# Altium project UPS_Input_Board.PrjPcb
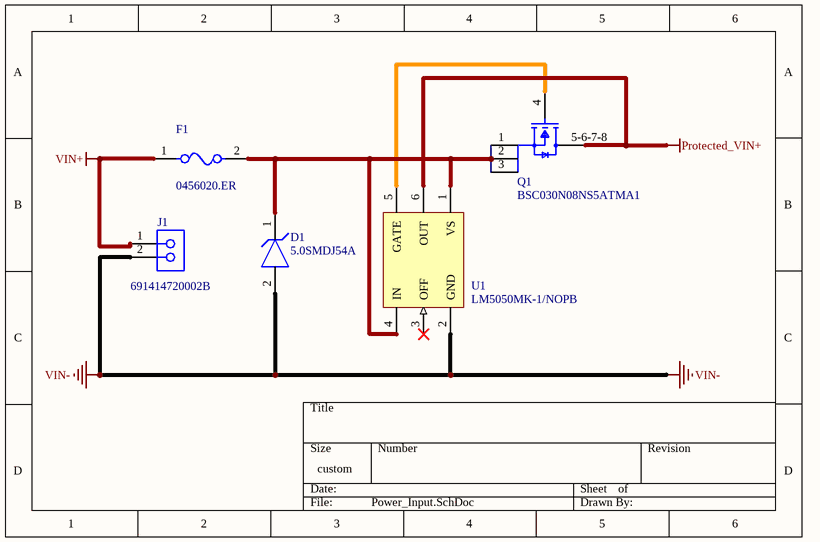
[diagram p0: Power_Input.SchDoc]
3 sheets, 15 parts. Net scope: flat (ports and power ports of the same name join across sheets).
Board file: UPS_Input_Board.PcbDoc
Sheets:
  Power_Input.SchDoc
  Battery_Charger.SchDoc
  Battery_Management.SchDoc

## Sheet Power_Input.SchDoc
size 149 x 100 mm; SheetNumber: 1; SheetTotal: 3

### Parts
D1  5.0SMDJ54A  [FP-5_0SMDJ-MFG]
F1  0456020.ER  [FP-0456-MFG]
J1  691414720002B  [691414720002B]
Q1  BSC030N08NS5ATMA1  [FP-PG-TDSON-8-MFG]
U1  LM5050MK-1/NOPB  [DDC0006A_N]

### Nets
Protected_VIN+: Q1.5-6-7-8(D) U1.6(OUT)
VIN+: F1.1 J1.1
VIN-: D1.2(A) J1.2 U1.2(GND)
NetD1_1: D1.1(C) F1.2 Q1.1(S) Q1.2(S) Q1.3(S) U1.1(VS) U1.4(IN)
NetQ1_4: Q1.4(G) U1.5(GATE)

Not connected (* = marked no-connect by the designer): U1 3(OFF)*

### Notes on the sheet
- Ochrona przed odwrotną polaryzacją.
  LM5050 nie otworzy tranzystora BSC gdy polaryzacja będzie odwrotna. Także jest to ochrona od prądu wstecznego, oraz redukcja ciepła bo BSC ma małą rezystancje w porównaniu do zwykłej diody prostowniczej.
  A dioda TVS chroni układ przed przepięciem zwierając prąd do masy po przekroczeniu 54V.

### Library data of the parts
D1 = CMP-08607-000114-1: TVS DIODE 54V 87.1V DO214AB; Peak Pulse Current: 57.5A; Number of Unidirectional Channels: 1; Test Current: 1mA; Polarity: Unidirectional; Peak Pulse Power: 5kW; Leakage Current: 5uA; Diode Type: ZENER; Breakdown Voltage: 60V; Power Line Protection: No; Packaging: Tape and Reel; Min Operating Temperature: -55°C; Max Operating Temperature: 150°C; Number of Pins: 2; Clamping Voltage: 87.1V; Mount: Surface Mount; Package Quantity: 3000; Case/Package: DO-214AB; Resistor Type: Zener; Lead Free: Lead Free; Operating Supply Voltage: 54V; Reverse Standoff Voltage: 54V; Min Breakdown Voltage: 60V; Termination: SMD/SMT; Number of Channels: 1; Max Surge Current: 57.5A; Reverse Breakdown Voltage: 60V; RoHS Compliant: Yes; Series: 5.0SMDJ; Number of Elements: 1
F1 = CMP-08605-000068-1: FUSE BOARD MNT 20A 125VAC 100VDC; Manufacturer: Littelfuse Inc; Fuse Interrupt Dc Current: 1000A; Fuse Voltage Drop: 64.7mV; Fuse Interrupt Ac Current: 300A; Fuse I2T: 18A2Sec; Max Fuse Dc Voltage: 100V; Voltage Rating: 125V; Value: 2.3mΩ; Fuse Blow Speed: Fast; RoHS: TRUE; Lead Free: Yes; Temperature Range High: +125°C; Device Class L3: unset; Octopart: https://octopart.com/0456020.er-littelfuse-7502596; Fuse Current: 20A; Digikey Description: FUSE BOARD MNT 20A 125VAC 100VDC; Category: Fuse; Temperature Range Low: -55°C; ComponentLink2URL: https://www.littelfuse.com/~/media/electronics/datasheets/fuses/littelfuse_fuse_456_datasheet.pdf.pdf; Automotive: No; Mouser Description: Surface Mount Fuses 125V 20A V/FA NANO2; Max Fuse Ac Voltage: 125V; Temperature: -55°C to +125°C; Manufacturer Part Number: 0456020.ER; Device Class L2: Fuses; Height: 3.05mm; Package: 0456; ComponentLink2Description: Datasheet; Device Class L1: Circuit Protection; Resistance: 2.3mΩ
J1 = CMP-1502-03072-3: Terminal Block, Wtb, 2Way, 28-14Awg Rohs Compliant: Yes; Stripping Length: -7mm; Number of Positions Per Level: 2; Voltage: 300V; Current: 15A; Wire Gauge (Max): 28AWG; Number of Levels: 1; Pitch: 5.0038mm; Wire Gauge (Min): 12AWG; Plating: Steel; Length: 14.3mm; Color: Grey, White; Width: 11mm; RoHS: Compliant; Max Operating Temperature: 105°C; Current Rating: 15A; Lead Pitch: 5mm; Termination: Screwless; Number of Contacts: 2; Packaging: Box; Contact Plating: Brass; Min Operating Temperature: -40°C; Housing Material: Nylon; Mount: Through Hole; Contact Material: Brass; Number of Pins: 2; Height: 12.9mm
Q1 = CMP-32901-000135-1: MOSFET N-CH 80V 100A 8TDSON; Manufacturer: Infineon; Typ Forward Diode Voltage: 0.9V; Drain To Source Resistance: 2.6mΩ; Number Of Channels: 1; Input Capacitace At Vds: 4300pF @ 40V; Transconductance: 110S; Pulse Drain Current: 400A; Reverse Recovery Time: 54ns; Gate To Source Voltage: 20V; Power Dissipation: 2.5W; Threshold Vgs Max: 3.8V; Rthja Max: 50K/W; Turn On Delay Time: 20ns; Reverse Recovery Charge: 94nC; Continuous Drain Current: 22A; Max Junction Temp: +150°C; Gate Charge At Vgs: 61nC @ 10V; Turn Off Delay Time: 43ns; Max Forward Diode Voltage: 1.1V; Depletion Mode: False; Threshold Vgs Min: 2.2V; Footprint Url: https://www.infineon.com/cms/en/product/packages/PG-TDSON/PG-TDSON-8-7/; Device Class L3: MOSFETs; Number Of N Channels: 1; Height: 1.1mm; Digikey Description: MOSFET N-CH 80V 100A 8TDSON; Octopart: https://octopart.com/bsc030n08ns5atma1-infineon-52825708; ComponentLink2URL: https://www.infineon.com/dgdl/Infineon-BSC030N08NS5-DS-v02_02-EN.pdf?fileId=5546d4624ad04ef9014aed52f4210acf; Category: Trans; Drain To Source Voltage: 80V; Package: PG-TDSON-8; Drain To Source Breakdown Voltage: 80V; Mouser Description: BSC030N08NS5ATMA1 N-Channel MOSFET, 100 A, 80 V BSC030N08NS5, 8-Pin TDSON Infineon; ComponentLink2Description: Datasheet; Device Class L1: Discrete Semiconductors; Device Class L2: Transistors; Automotive: No; Manufacturer Part Number: BSC030N08NS5ATMA1; RoHS: TRUE; Temperature Range Low: -55°C; Temperature: -55°C to +150°C; Lead Free: Yes; Temperature Range High: +150°C
U1 = CMP-0063-01524-2: High Side OR-ing FET Controller, 6-pin TSOT, 1000 Reel; Manufacturer: Texas Instruments; CompType: MiscPower; PowerWise: Y; PackageTopMarking: SZHB*XTT; Code_IPC: SOT26A-6; ComponentLink1URL: http://www.ti.com/general/docs/lit/getliterature.tsp?genericPartNumber=LM5050-1&fileType=pdf; PinCount: 6; RoHS: Y; PartNumber: LM5050MK-1/NOPB; ComponentLink1Description: Datasheet URL; Code_JEDEC: MO-193-AA; PackageDescription: Molded TSOT, 2.97 x 1.65 x 0.87mm Body, 6 Lead, 0.95mm Pitch; High-Reliability: Y; PackageReference: DDC0006A

## Sheet Battery_Charger.SchDoc
size A4; SheetNumber: 2; SheetTotal: 3
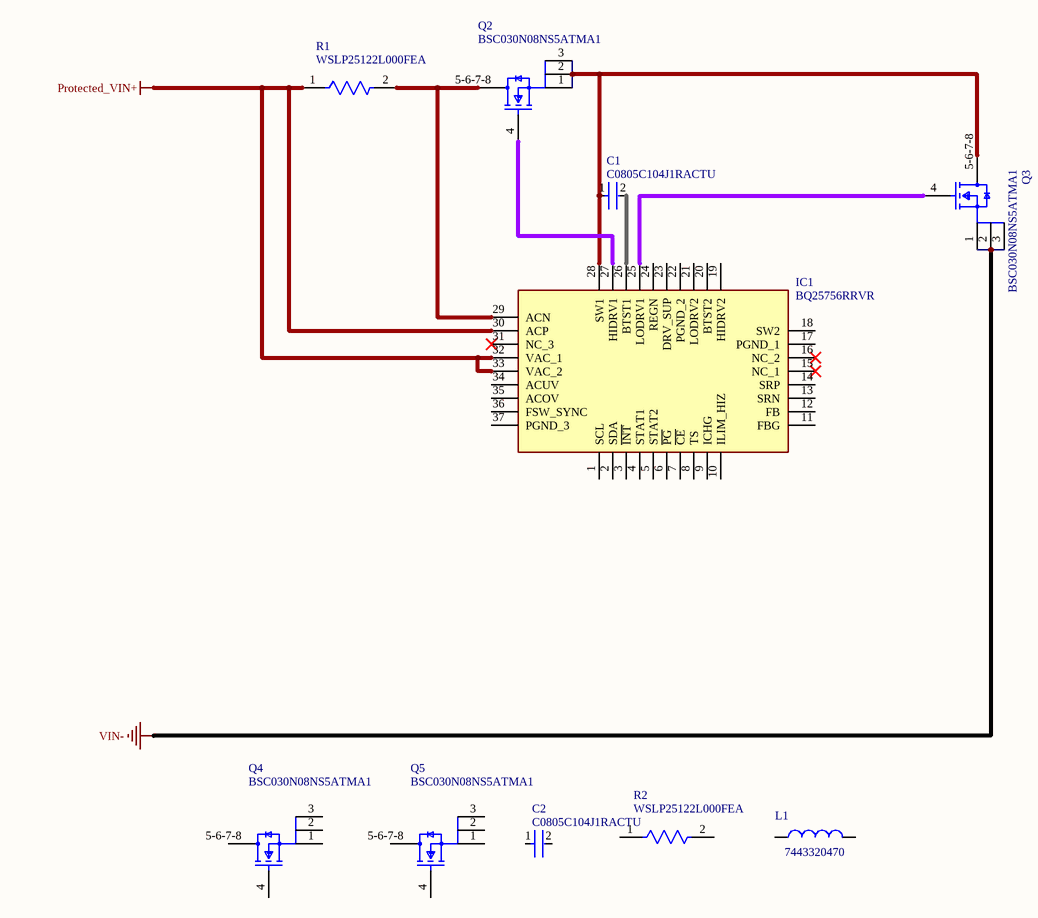
[diagram p1: Battery_Charger.SchDoc]

### Parts
C1  C0805C104J1RACTU  [FP-C0805C-DN-MFG]
C2  C0805C104J1RACTU  [FP-C0805C-DN-MFG]
IC1  BQ25756RRVR  [QFN50P500X600X100-37N-D]
L1  7443320470  [WE-HCC_1210]
Q2  BSC030N08NS5ATMA1  [FP-PG-TDSON-8-MFG]
Q3  BSC030N08NS5ATMA1  [FP-PG-TDSON-8-MFG]
Q4  BSC030N08NS5ATMA1  [FP-PG-TDSON-8-MFG]
Q5  BSC030N08NS5ATMA1  [FP-PG-TDSON-8-MFG]
R1  WSLP25122L000FEA  [FP-WSLP2512-0R001-0R0049-MFG]
R2  WSLP25122L000FEA  [FP-WSLP2512-0R001-0R0049-MFG]

### Nets
Protected_VIN+: IC1.30(ACP) IC1.32(VAC_1) IC1.33(VAC_2) R1.1
VIN-: Q3.1(S) Q3.2(S) Q3.3(S)
NetC1_1: C1.1 IC1.28(SW1) Q2.1(S) Q2.2(S) Q2.3(S) Q3.5-6-7-8(D)
NetC1_2: C1.2 IC1.26(BTST1)
NetIC1_25: IC1.25(LODRV1) Q3.4(G)
NetIC1_27: IC1.27(HIDRV1) Q2.4(G)
NetIC1_29: IC1.29(ACN) Q2.5-6-7-8(D) R1.2

Not connected (* = marked no-connect by the designer): C2 1 2; IC1 1(SCL) 2(SDA) 3(~{INT}) 4(STAT1) 5(STAT2) 6(~{PG}) 7(~{CE}) 8(TS) 9(ICHG) 10(ILIM_HIZ) 11(FBG) 12(FB) 13(SRN) 14(SRP) 15(NC_1)* 16(NC_2)* 17(PGND_1) 18(SW2) 19(HIDRV2) 20(BTST2) 21(LODRV2) 22(PGND_2) 23(DRV_SUP) 24(REGN) 31(NC_3)* 34(ACUV) 35(ACOV) 36(FSW_SYNC) 37(PGND_3); L1 1 2; Q4 1(S) 2(S) 3(S) 4(G) 5-6-7-8(D); Q5 1(S) 2(S) 3(S) 4(G) 5-6-7-8(D); R2 1 2

### Library data of the parts
C1 C2 = CMP-1036-04426-3: CAP CER 0.1UF 100V 5% X7R 0805; Manufacturer: KEMET; Capacitance: 0.10 μF; Temperature Coefficient: 30ppm/°C; Value: 0.10 μF; Tolerance: 0.05; Description: C0805 0.10 μF X7R 30ppm/°C 5.00% 100 V; Material: Ceramic; Digikey Description: CAP CER 0.1UF 100V 5% X7R 0805; RoHS: TRUE; Octopart: https://octopart.com/c0805c104j1ractu-kemet-10469001; Automotive: No; Mouser Description: Multilayer Ceramic Capacitors MLCC - SMD/SMT 100V 0.1uF 5% X7R; Device Class L3: Ceramic Capacitors; Temperature: -55°C to +125°C; Temperature Range High: +125°C; ComponentLink2Description: Datasheet; Manufacturer Part Number: C0805C104J1RACTU; ComponentLink2URL: https://content.kemet.com/datasheets/KEM_C1003_C0G_SMD.pdf; Device Class L2: Capacitors; Device Class L1: Passive Components; Category: Cap; Temperature Characteristic: X7R; Voltage Rating: 100 V; Temperature Range Low: -55°C; Package: C0805C-DN; Height: 0.88mm; Ipc Land Pattern Name: CAPC200125X78; Lead Free: Yes
IC1 = BQ25756RRVR: Integrated Circuit; Manufacturer_Name: Texas Instruments; Datasheet Link: https://www.ti.com.cn/cn/lit/ds/symlink/bq25756.pdf?ts=1699839190732&ref_url=https%253A%252F%252Fwww.ti.com.cn%252Fproduct%252Fcn%252FBQ25756; Height: 1mm; Manufacturer_Part_Number: BQ25756RRVR; Mouser Part Number: 595-BQ25756RRVR; Mouser Price/Stock: https://www.mouser.co.uk/ProductDetail/Texas-Instruments/BQ25756RRVR?qs=HoCaDK9Nz5ckDWwb4xOATA%3D%3D; Arrow Part Number: BQ25756RRVR; Arrow Price/Stock: https://www.arrow.com/en/products/bq25756rrvr/texas-instruments.html?utm_currency=USD&region=nac; Supplier 1: Mouser; Supplier Part Number 1: 595-BQ25756RRVR
L1 = CMP-0226-00121-3: We-hcc Series, Shielded Wire-wound SMD Inductor With Ferrite Core, 4.7 Uh; Inductance Tolerance: 20%; Self Resonant Frequency: 43MHz; Saturation Current: 15.6A; Current Rating: 15.5A; Inductance: 4.7µH; DC Resistance (DCR): 7.25mΩ; Width: 11.4mm; Core Material: Ferrite; Number of Pins: 2; Material: Ferrite; RoHS: Compliant; Length: 12.1mm; Max Operating Temperature: 125°C; Ambient Temperature Range Low: -40°C; Min Operating Temperature: -40°C; Height: 9.5mm; Ambient Temperature Range High: 75°C
Q2-Q5 = CMP-32901-000135-1: as Q1 on sheet Power_Input; Footprint Url: https://www.infineon.com/cms/en/product/packages/PG-TDSON/PG-TDSON-8-7/; Device Class L3: MOSFETs; Number Of N Channels: 1; Height: 1.1mm; Digikey Description: MOSFET N-CH 80V 100A 8TDSON; Octopart: https://octopart.com/bsc030n08ns5atma1-infineon-52825708; ComponentLink2URL: https://www.infineon.com/dgdl/Infineon-BSC030N08NS5-DS-v02_02-EN.pdf?fileId=5546d4624ad04ef9014aed52f4210acf; Category: Trans; Drain To Source Voltage: 80V; Package: PG-TDSON-8; Drain To Source Breakdown Voltage: 80V; Mouser Description: BSC030N08NS5ATMA1 N-Channel MOSFET, 100 A, 80 V BSC030N08NS5, 8-Pin TDSON Infineon; ComponentLink2Description: Datasheet; Device Class L1: Discrete Semiconductors; Device Class L2: Transistors; Automotive: No; Manufacturer Part Number: BSC030N08NS5ATMA1; RoHS: TRUE; Temperature Range Low: -55°C; Temperature: -55°C to +150°C; Lead Free: Yes; Temperature Range High: +150°C
R1 R2 = CMP-02407-010958-1: RES 0.002 OHM 1% 3W 2512; Resistance: 2MR; Temperature Coefficient: 275ppm/°C; Size Code: 2512; Width: 3.2mm; Resistor Type: Metal Strip; Packaging: Tape and Reel; Weight: 0.001429oz; RoHS Compliant: Yes; Case Code (Metric): 6432; Case/Package: 2512; Tolerance: 1%; Length: 6.4mm; Case Code (Imperial): 2512; Power Rating: 3W; Min Operating Temperature: -65°C; Mount: Surface Mount; Max Operating Temperature: 170°C; Package Quantity: 2000; Series: WSLP; Height: 0.635mm; Termination: SMD/SMT; Lead Free: Lead Free

## Sheet Battery_Management.SchDoc
size A4; SheetNumber: 3; SheetTotal: 3

## Nets that join several sheets
Protected_VIN+: Power_Input (Q1.5-6-7-8 U1.6), Battery_Charger (IC1.30 IC1.32 IC1.33 R1.1)
VIN-: Power_Input (D1.2 J1.2 U1.2), Battery_Charger (Q3.1 Q3.2 Q3.3)